# EAGLE schematic Synth (EAGLE 9.6.2)

## Sheet 1 of 3
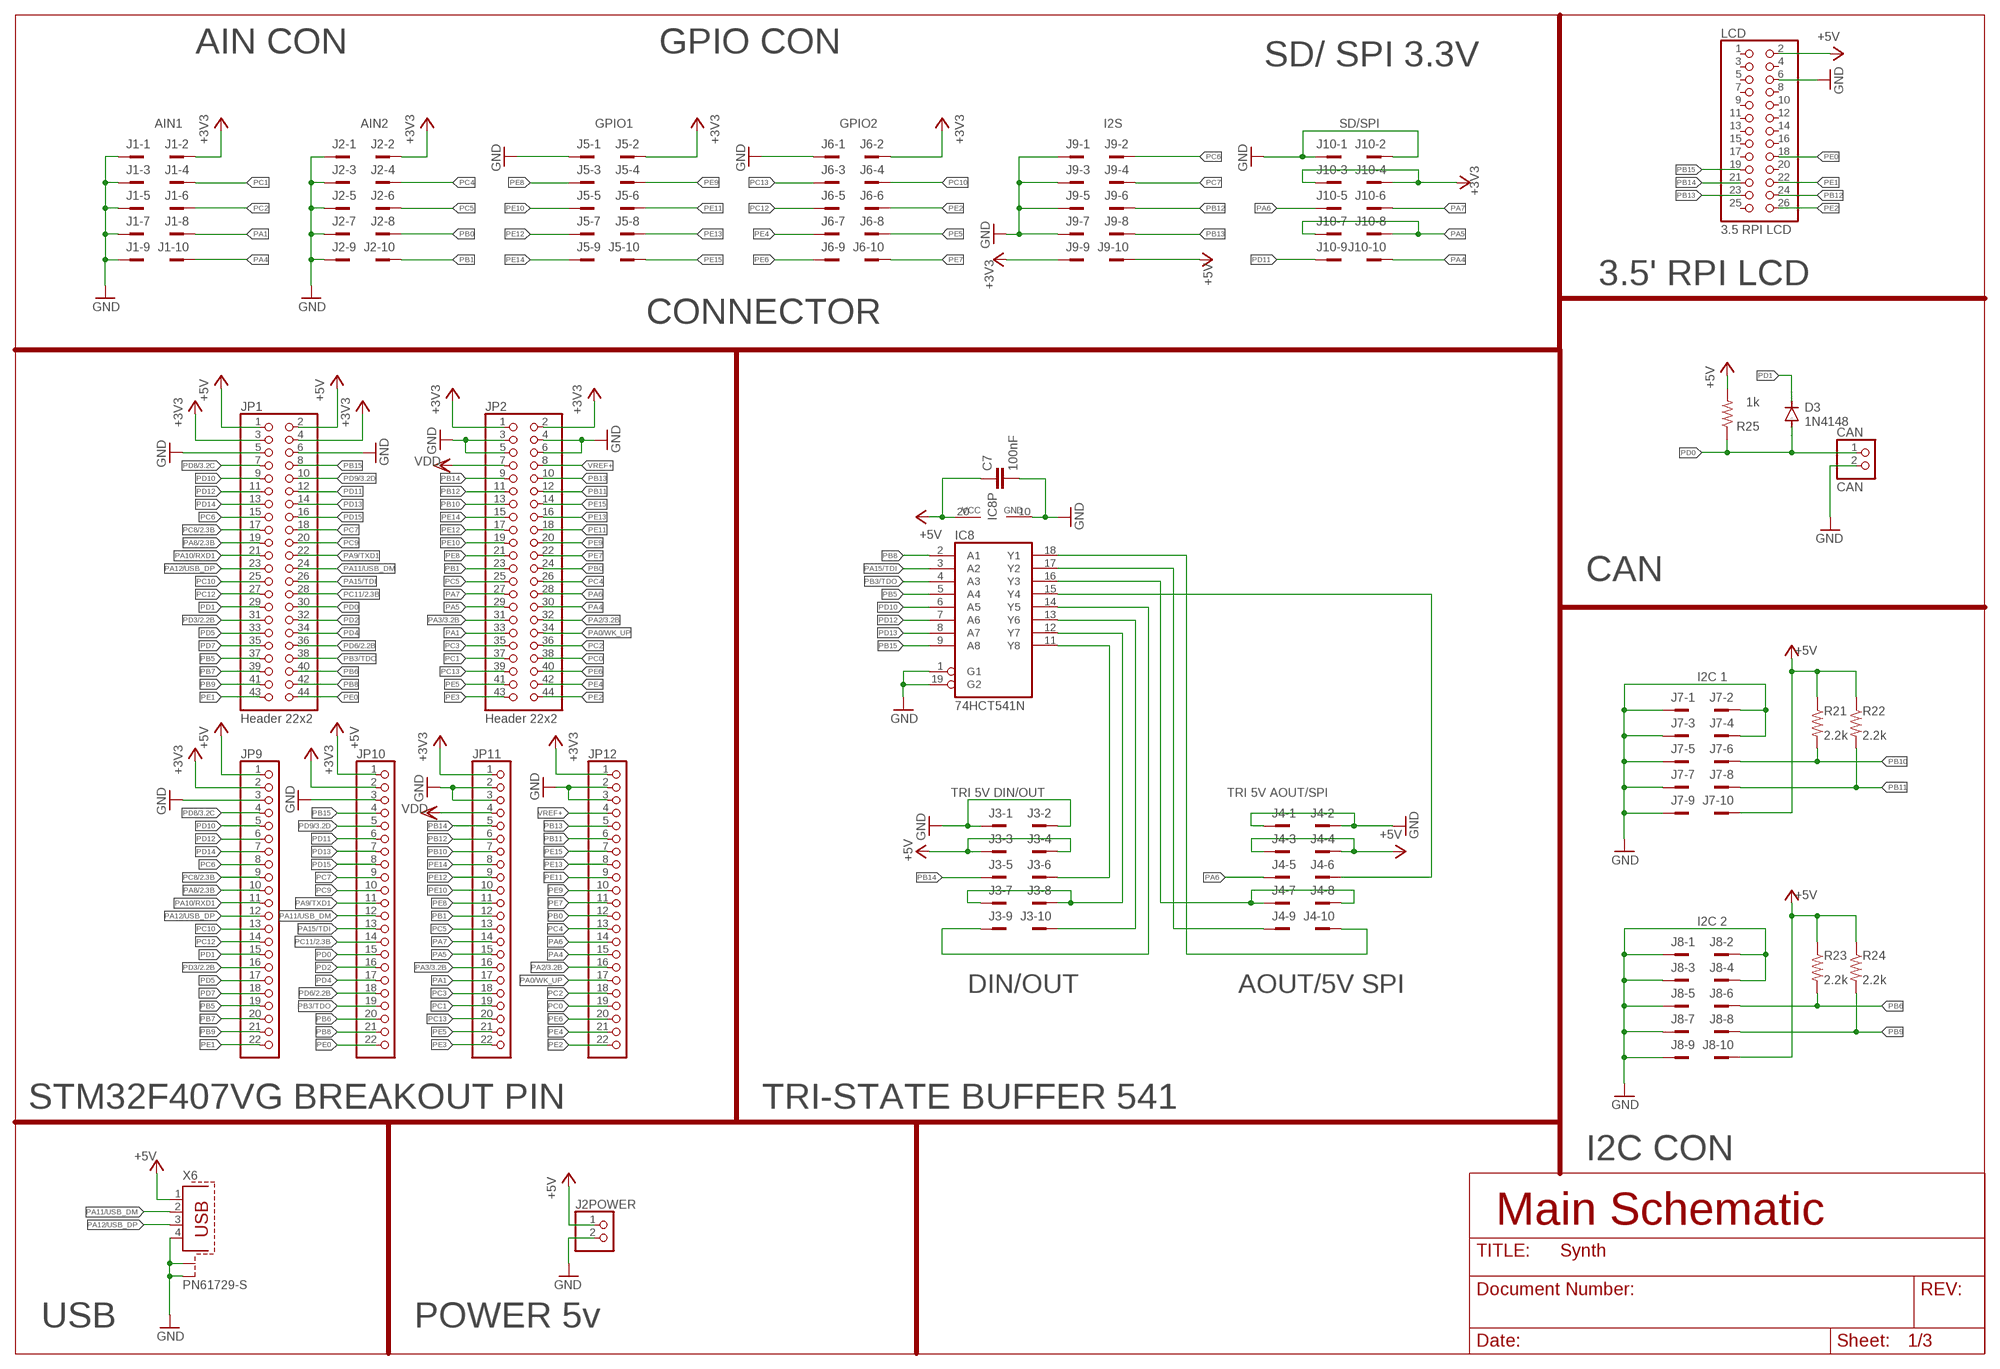
[diagram p0: schematic, sheet 1]
FRAME1 (DINA3_L): TITLE: Main Schematic

### Parts
C7  100nF  C-EU025-025X050  [C025-025X050]
CAN  CAN  PINHD-1X2  [1X02]
D3  1N4148  1N4148DO35-10  [DO35-10]
IC8  74HCT541N  [DIL20]
J1  AIN1  2510-  [PAK100/2500-10]
J2  AIN2  2510-  [PAK100/2500-10]
J2POWER  PINHD-1X2  [1X02]
J3  TRI 5V DIN/OUT  2510-  [PAK100/2500-10]
J4  TRI 5V AOUT/SPI  2510-  [PAK100/2500-10]
J5  GPIO1  2510-  [PAK100/2500-10]
J6  GPIO2  2510-  [PAK100/2500-10]
J7  I2C 1  2510-  [PAK100/2500-10]
J8  I2C 2  2510-  [PAK100/2500-10]
J9  I2S  2510-  [PAK100/2500-10]
J10  SD/SPI  2510-  [PAK100/2500-10]
JP1  Header 22x2  PINHD-2X22  [2X22]
JP2  Header 22x2  PINHD-2X22  [2X22]
JP9  PINHD-1X22  [1X22]
JP10  PINHD-1X22  [1X22]
JP11  PINHD-1X22  [1X22]
JP12  PINHD-1X22  [1X22]
LCD  3.5 RPI LCD  PINHD-2X13  [2X13]
R21  2.2k  R-US_0207/10  [0207/10]
R22  2.2k  R-US_0207/10  [0207/10]
R23  2.2k  R-US_0207/10  [0207/10]
R24  2.2k  R-US_0207/10  [0207/10]
R25  1k  R-US_0207/10  [0207/10]
X6  PN61729-S  [PN61729-S]

### Nets
+3V3: J1.2 J2.2 J5.2 J6.2 J9.9 J10.3 J10.4 JP1.3 JP1.4 JP2.1 JP2.2 JP9.2 JP10.2 JP11.1 JP12.1 ; also sheet 2
+5V: C7.1 IC8.20(VCC) J2POWER.1 J3.3 J3.4 J4.3 J4.4 J7.10 J8.10 J9.10 JP1.1 JP1.2 JP9.1 JP10.1 LCD.2 R21.1 R22.1 R23.1 R24.1 R25.2 X6.1 ; also sheet 2,3
GND: C7.2 CAN.2 IC8.1(G1) IC8.10(GND) IC8.19(G2) J1.1 J1.3 J1.5 J1.7 J1.9 J2.1 J2.3 J2.5 J2.7 J2.9 J2POWER.2 J3.1 J3.2 J4.1 J4.2 J5.1 J6.1 J7.1 J7.2 J7.3 J7.4 J7.5 J7.7 J7.9 J8.1 J8.2 J8.3 J8.4 J8.5 J8.7 J8.9 J9.1 J9.3 J9.5 J9.7 J10.1 J10.2 JP1.5 JP1.6 JP2.3 JP2.4 JP2.5 JP2.6 JP9.3 JP10.3 JP11.2 JP11.3 JP12.2 JP12.3 LCD.6 X6.4 X6.S1 X6.S2 ; also sheet 2,3
N$37: IC8.15(Y4) J4.6
N$38: IC8.12(Y7) J3.7 J3.8
N$39: IC8.11(Y8) J3.6
N$40: IC8.13(Y6) J3.10
N$41: IC8.14(Y5) J3.9
N$43: IC8.16(Y3) J4.7 J4.8
N$44: IC8.17(Y2) J4.9
N$45: IC8.18(Y1) J4.10
PA0/WK_UP: JP2.34 JP12.17
PA1: J1.8 JP2.33 JP11.17
PA2: JP2.32 JP12.16 ; also sheet 3
PA3: JP2.31 JP11.16 ; also sheet 3
PA4: J1.10 J10.10 JP2.30 JP12.15
PA5: J10.7 J10.8 JP2.29 JP11.15
PA6: J4.5 J10.5 JP2.28 JP12.14
PA7: J10.6 JP2.27 JP11.14
PA8: JP1.19 JP9.10 ; also sheet 2
PA9/TXD1: JP1.22 JP10.11
PA10/RXD1: JP1.21 JP9.11
PA11/USB_DM: JP1.24 JP10.12 X6.2
PA12/USB_DP: JP1.23 JP9.12 X6.3
PA15/TDI: IC8.3(A2) JP1.26 JP10.13
PB0: J2.8 JP2.24 JP12.12
PB1: J2.10 JP2.23 JP11.12
PB3/TDO: IC8.4(A3) JP1.38 JP10.19
PB5: IC8.5(A4) JP1.37 JP9.19
PB6: J8.6 JP1.40 JP10.20 R23.2
PB7: JP1.39 JP9.20
PB8: IC8.2(A1) JP1.42 JP10.21
PB9: J8.8 JP1.41 JP9.21 R24.2
PB10: J7.6 JP2.13 JP11.7 R21.2
PB11: J7.8 JP2.12 JP12.6 R22.2
PB12: J9.6 JP2.11 JP11.6 LCD.24
PB13: J9.8 JP2.10 JP12.5 LCD.23
PB14: J3.5 JP2.9 JP11.5 LCD.21
PB15: IC8.9(A8) JP1.8 JP10.4 LCD.19
PC0: JP2.38 JP12.19
PC1: J1.4 JP2.37 JP11.19
PC2: J1.6 JP2.36 JP12.18
PC3: JP2.35 JP11.18
PC4: J2.4 JP2.26 JP12.13
PC5: J2.6 JP2.25 JP11.13
PC6: J9.2 JP1.15 JP9.8
PC7: J9.4 JP1.18 JP10.9
PC8: JP1.17 JP9.9 ; also sheet 2
PC9: JP1.20 JP10.10
PC10: J6.4 JP1.25 JP9.13
PC11: JP1.28 JP10.14 ; also sheet 2
PC12: J6.5 JP1.27 JP9.14
PC13: J6.3 JP2.39 JP11.20
PD0: CAN.1 D3.A JP1.30 JP10.15 R25.1
PD1: D3.C JP1.29 JP9.15
PD2: JP1.32 JP10.16
PD3: JP1.31 JP9.16 ; also sheet 2
PD4: JP1.34 JP10.17
PD5: JP1.33 JP9.17
PD6: JP1.36 JP10.18 ; also sheet 2
PD7: JP1.35 JP9.18
PD8: JP1.7 JP9.4 ; also sheet 3
PD9: JP1.10 JP10.5 ; also sheet 3
PD10: IC8.6(A5) JP1.9 JP9.5
PD11: J10.9 JP1.12 JP10.6
PD12: IC8.7(A6) JP1.11 JP9.6
PD13: IC8.8(A7) JP1.14 JP10.7
PD14: JP1.13 JP9.7
PD15: JP1.16 JP10.8
PE0: JP1.44 JP10.22 LCD.18
PE1: JP1.43 JP9.22 LCD.22
PE2: J6.6 JP2.44 JP12.22 LCD.26
PE3: JP2.43 JP11.22
PE4: J6.7 JP2.42 JP12.21
PE5: J6.8 JP2.41 JP11.21
PE6: J6.9 JP2.40 JP12.20
PE7: J6.10 JP2.22 JP12.11
PE8: J5.3 JP2.21 JP11.11
PE9: J5.4 JP2.20 JP12.10
PE10: J5.5 JP2.19 JP11.10
PE11: J5.6 JP2.18 JP12.9
PE12: J5.7 JP2.17 JP11.9
PE13: J5.8 JP2.16 JP12.8
PE14: J5.9 JP2.15 JP11.8
PE15: J5.10 JP2.14 JP12.7
VDD: JP2.7 JP11.4
VREF+: JP2.8 JP12.4
Unconnected: LCD.1 LCD.3 LCD.4 LCD.5 LCD.7 LCD.8 LCD.9 LCD.10 LCD.11 LCD.12 LCD.13 LCD.14 LCD.15 LCD.16 LCD.17 LCD.20 LCD.25

### Notes on the sheet
- AIN CON | GPIO CON
- SD/ SPI 3.3V
- 3.5' RPI LCD
- CONNECTOR
- CAN
- DIN/OUT | AOUT/5V SPI
- STM32F407VG BREAKOUT PIN | TRI-STATE BUFFER 541
- I2C CON
- USB | POWER 5v

## Sheet 2 of 3
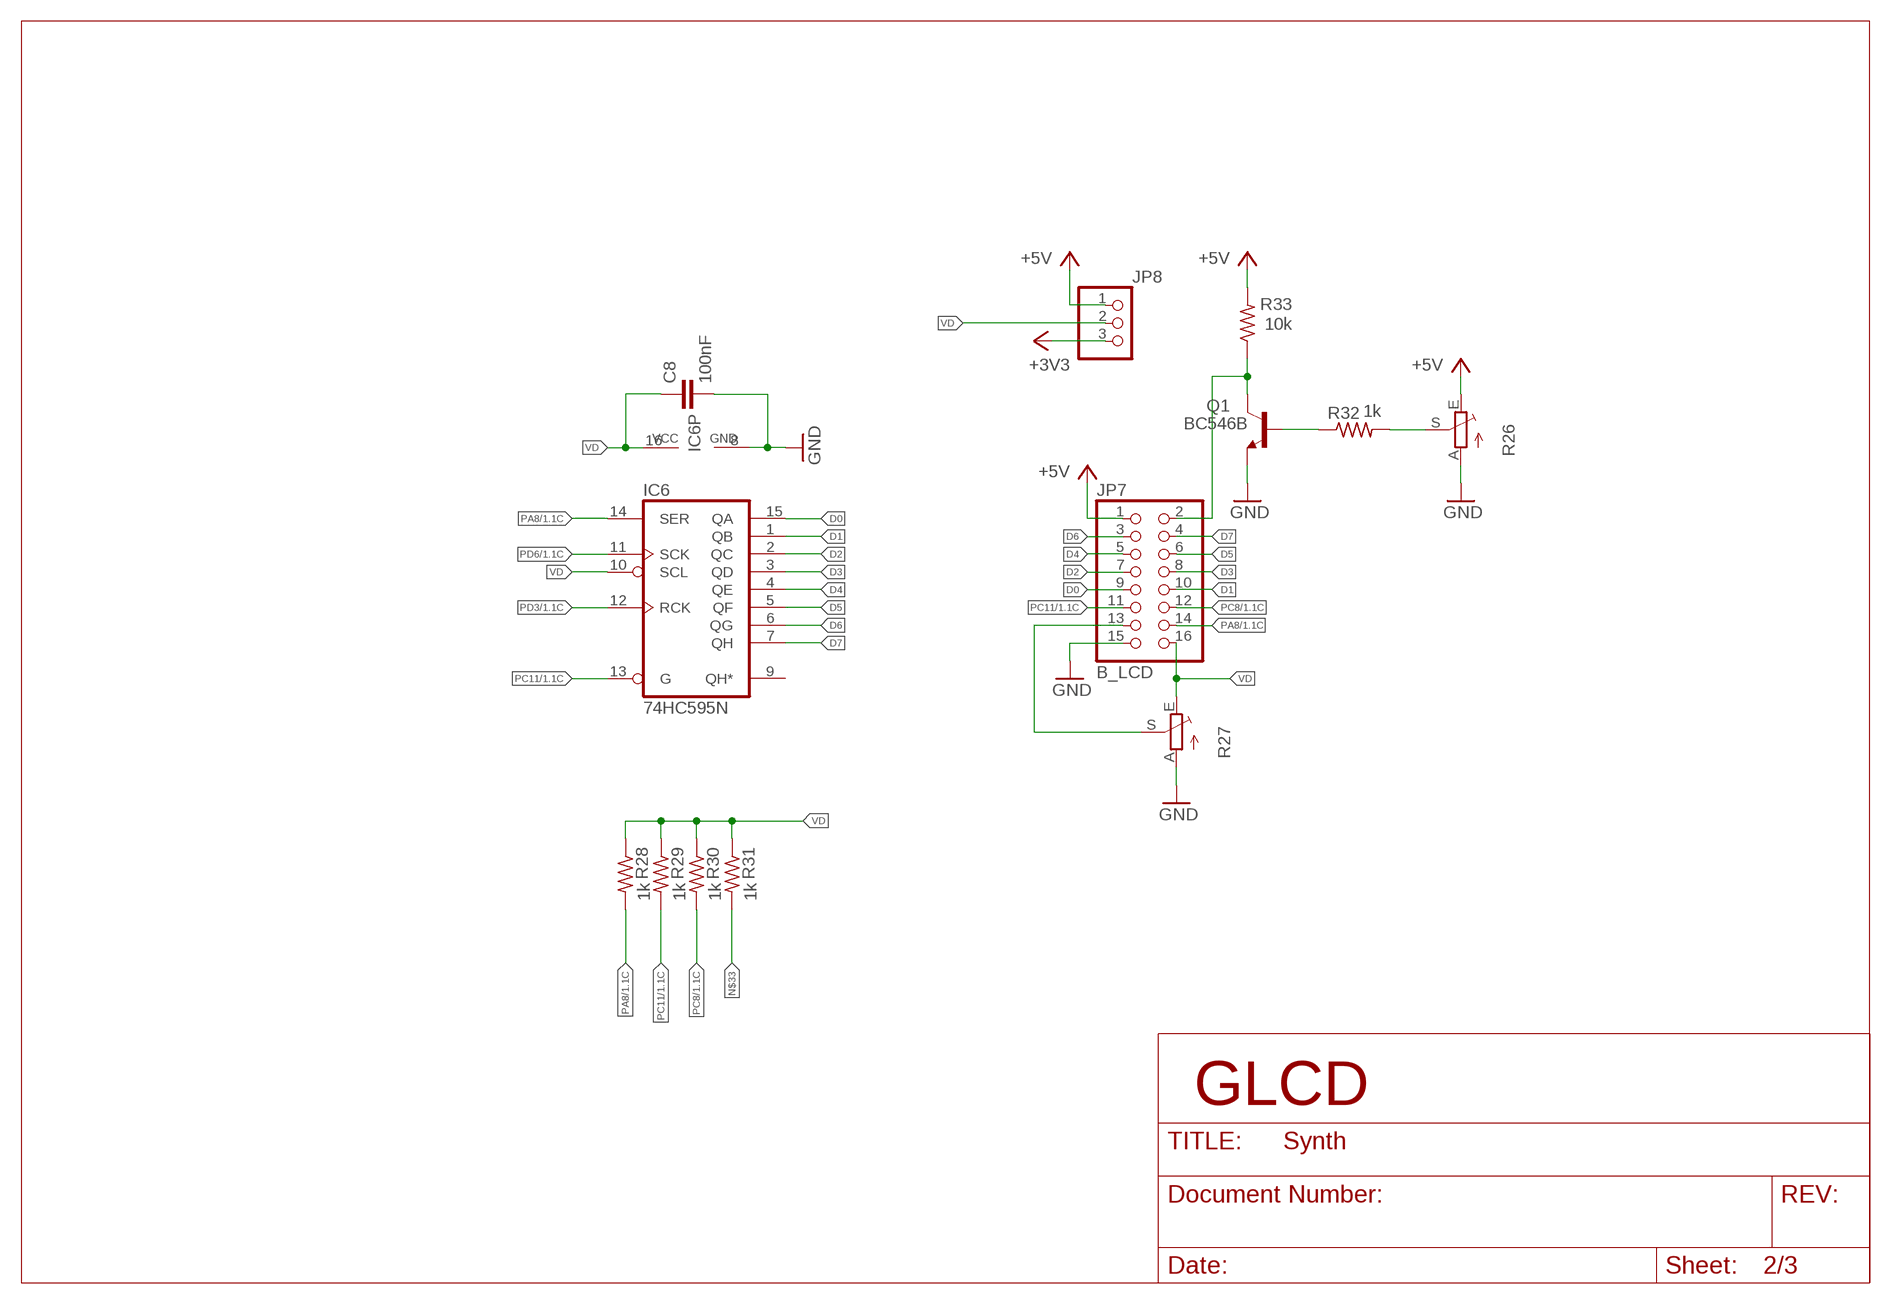
[diagram p1: schematic, sheet 2]
FRAME2 (DINA4_L): TITLE: GLCD

### Parts
C8  100nF  C-EU025-025X050  [C025-025X050]
IC6  74HC595N  [DIL16]
JP7  B_LCD  PINHD-2X8  [2X08]
JP8  PINHD-1X3  [1X03]
Q1  BC546B  [TO92-EBC]
R26  TRIM_EU-CA6V  [CA6V]
R27  TRIM_EU-CA6V  [CA6V]
R28  1k  R-US_0207/10  [0207/10]
R29  1k  R-US_0207/10  [0207/10]
R30  1k  R-US_0207/10  [0207/10]
R31  1k  R-US_0207/10  [0207/10]
R32  1k  R-US_0207/10  [0207/10]
R33  10k  R-US_0207/10  [0207/10]

### Nets
+3V3: JP8.3 ; also sheet 1
+5V: JP7.1 JP8.1 R26.E R33.2 ; also sheet 1,3
D0: IC6.15(QA) JP7.9
D1: IC6.1(QB) JP7.10
D2: IC6.2(QC) JP7.7
D3: IC6.3(QD) JP7.8
D4: IC6.4(QE) JP7.5
D5: IC6.5(QF) JP7.6
D6: IC6.6(QG) JP7.3
D7: IC6.7(QH) JP7.4
GND: C8.2 IC6.8(GND) JP7.15 Q1.E R26.A R27.A ; also sheet 1,3
N$30: JP7.13 R27.S
N$33: R31.2
N$46: JP7.2 Q1.C R33.1
N$47: Q1.B R32.1
N$48: R26.S R32.2
PA8: IC6.14(SER) JP7.14 R28.2 ; also sheet 1
PC8: JP7.12 R30.2 ; also sheet 1
PC11: IC6.13(G) JP7.11 R29.2 ; also sheet 1
PD3: IC6.12(RCK) ; also sheet 1
PD6: IC6.11(SCK) ; also sheet 1
VD: C8.1 IC6.10(SCL) IC6.16(VCC) JP7.16 JP8.2 R27.E R28.1 R29.1 R30.1 R31.1
Unconnected: IC6.9(QH*)

## Sheet 3 of 3
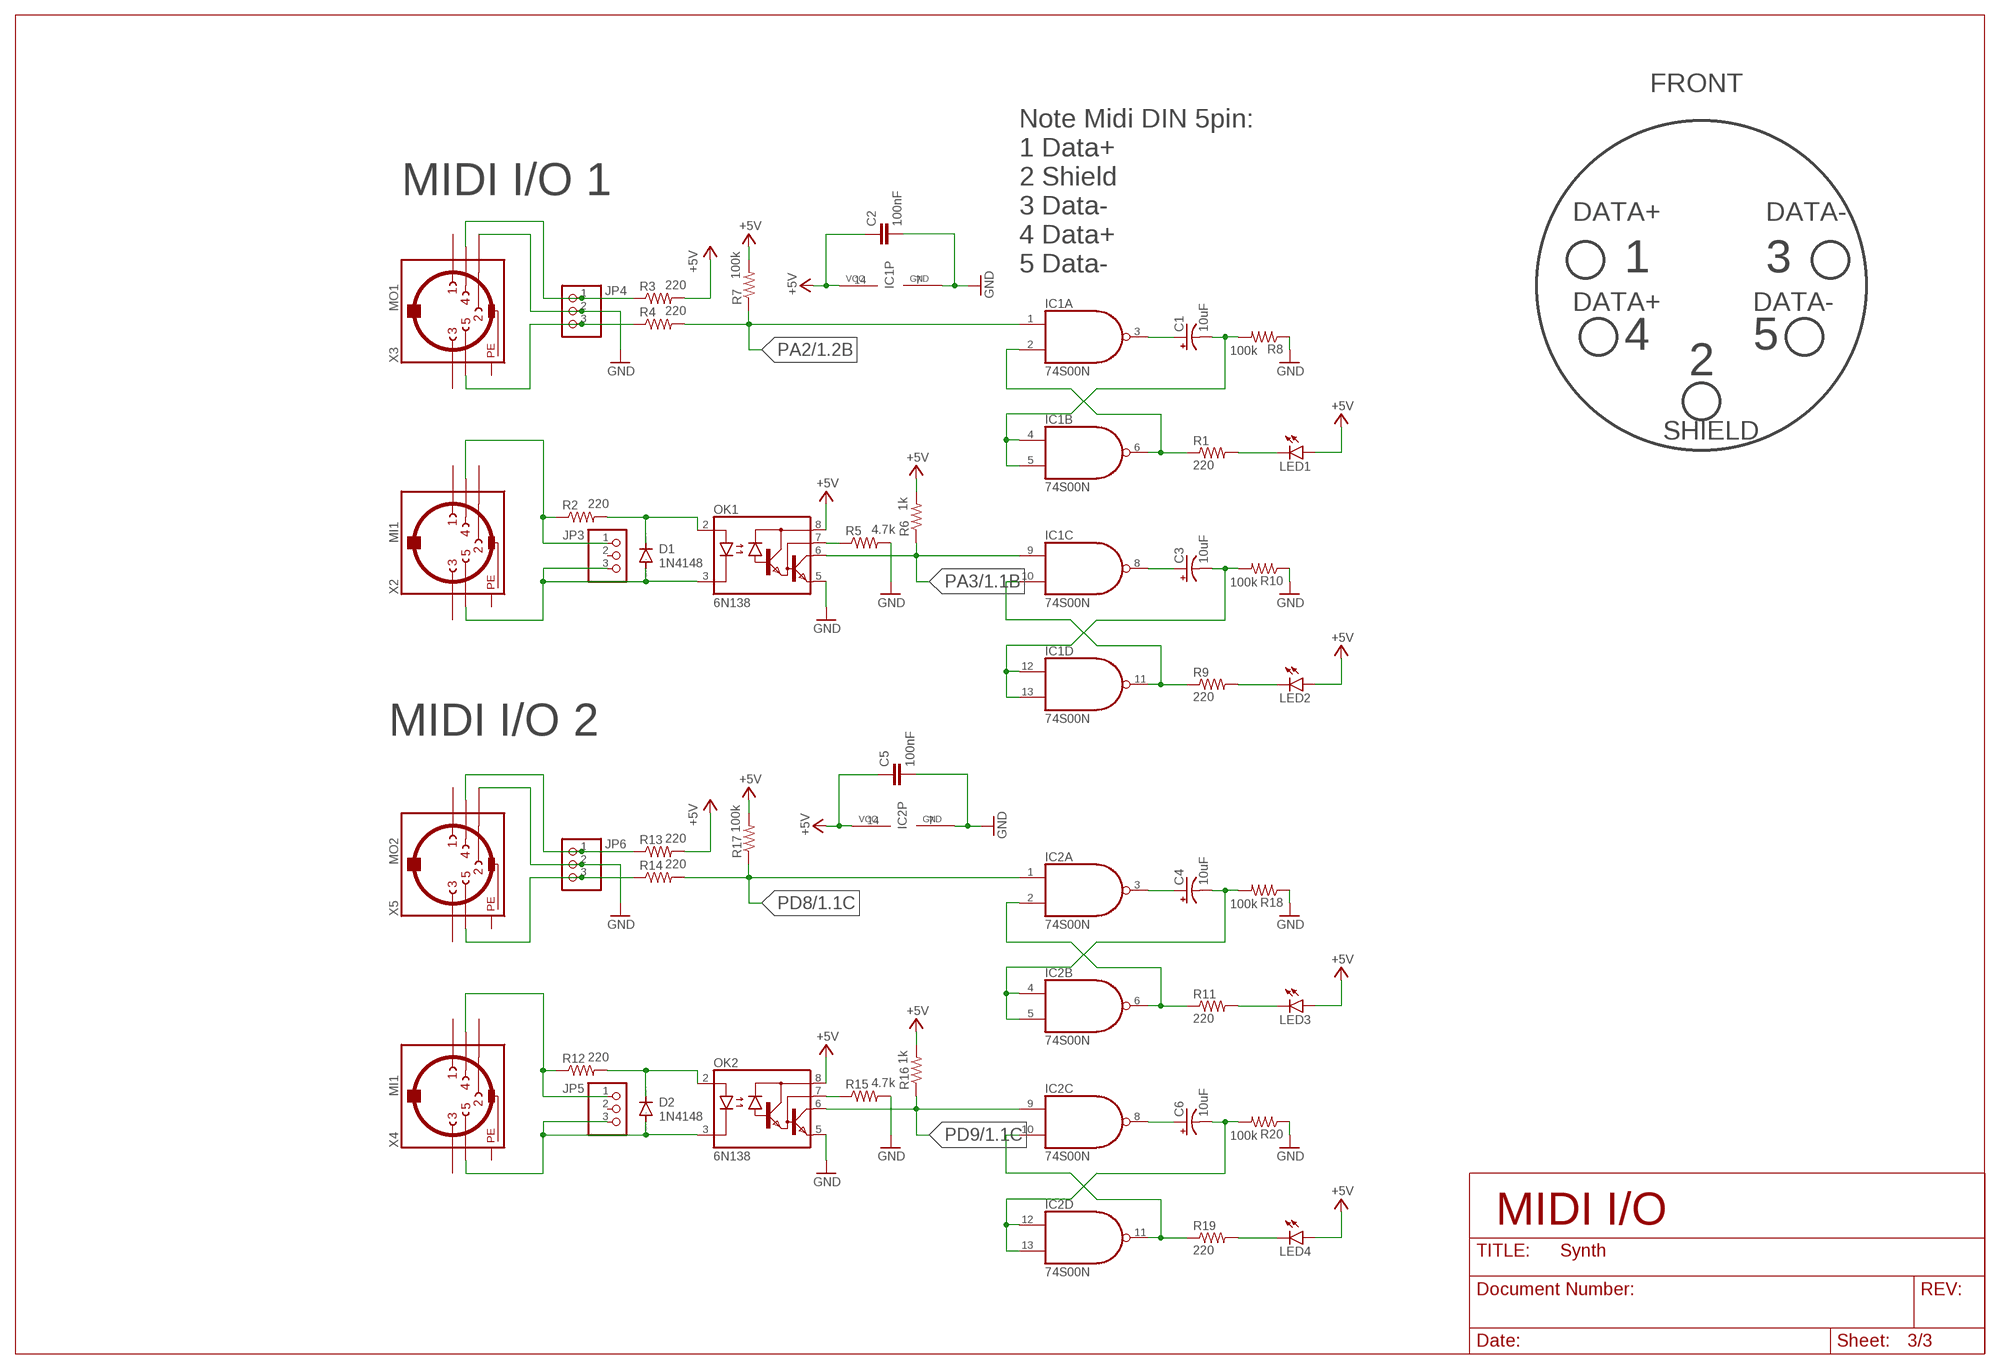
[diagram p2: schematic, sheet 3]
FRAME3 (DINA3_L): TITLE: MIDI I/O

### Parts
C1  10uF  CPOL-USE3.5-8  [E3,5-8]
C2  100nF  C-EU025-025X050  [C025-025X050]
C3  10uF  CPOL-USE3.5-8  [E3,5-8]
C4  10uF  CPOL-USE3.5-8  [E3,5-8]
C5  100nF  C-EU025-025X050  [C025-025X050]
C6  10uF  CPOL-USE3.5-8  [E3,5-8]
D1  1N4148  1N4148DO35-10  [DO35-10]
D2  1N4148  1N4148DO35-10  [DO35-10]
IC1  74S00N  [DIL14]
IC2  74S00N  [DIL14]
JP3  PINHD-1X3  [1X03]
JP4  PINHD-1X3  [1X03]
JP5  PINHD-1X3  [1X03]
JP6  PINHD-1X3  [1X03]
LED1  LED3MM  [LED3MM]
LED2  LED3MM  [LED3MM]
LED3  LED3MM  [LED3MM]
LED4  LED3MM  [LED3MM]
OK1  6N138  [DIL08]
OK2  6N138  [DIL08]
R1  220  R-US_0207/10  [0207/10]
R2  220  R-US_0207/10  [0207/10]
R3  220  R-US_0207/10  [0207/10]
R4  220  R-US_0207/10  [0207/10]
R5  4.7k  R-US_0207/10  [0207/10]
R6  1k  R-US_0207/10  [0207/10]
R7  100k  R-US_0207/10  [0207/10]
R8  100k  R-US_0207/10  [0207/10]
R9  220  R-US_0207/10  [0207/10]
R10  100k  R-US_0207/10  [0207/10]
R11  220  R-US_0207/10  [0207/10]
R12  220  R-US_0207/10  [0207/10]
R13  220  R-US_0207/10  [0207/10]
R14  220  R-US_0207/10  [0207/10]
R15  4.7k  R-US_0207/10  [0207/10]
R16  1k  R-US_0207/10  [0207/10]
R17  100k  R-US_0207/10  [0207/10]
R18  100k  R-US_0207/10  [0207/10]
R19  220  R-US_0207/10  [0207/10]
R20  100k  R-US_0207/10  [0207/10]
X2  MI1  MAB5SH  [MAB5SH]
X3  MO1  MAB5SH  [MAB5SH]
X4  MI1  MAB5SH  [MAB5SH]
X5  MO2  MAB5SH  [MAB5SH]

### Nets
+5V: C2.1 C5.1 IC1.14(P:VCC) IC2.14(P:VCC) LED1.A LED2.A LED3.A LED4.A OK1.8(VCC) OK2.8(VCC) R3.2 R6.2 R7.2 R13.2 R16.2 R17.2 ; also sheet 1,2
GND: C2.2 C5.2 IC1.7(P:GND) IC2.7(P:GND) JP4.2 JP6.2 OK1.5(GND) OK2.5(GND) R5.2 R8.1 R10.1 R15.2 R18.1 R20.1 X3.2 X5.2 ; also sheet 1,2
N$1: D1.C OK1.2(A) R2.2
N$2: D1.A JP3.3 OK1.3(C) X2.5
N$3: JP3.1 R2.1 X2.4
N$4: D2.C OK2.2(A) R12.2
N$5: OK1.7(VB) R5.1
N$6: JP4.3 R4.1 X3.5
N$7: D2.A JP5.3 OK2.3(C) X4.5
N$8: JP4.1 R3.1 X3.4
N$9: IC1.2(A:I1) IC1.6(B:O) R1.1
N$10: C1.- IC1.4(B:I0) IC1.5(B:I1) R8.2
N$11: C1.+ IC1.3(A:O)
N$12: LED1.K(C) R1.2
N$13: IC1.10(C:I1) IC1.11(D:O) R9.1
N$14: C3.- IC1.12(D:I0) IC1.13(D:I1) R10.2
N$15: C3.+ IC1.8(C:O)
N$16: LED2.K(C) R9.2
N$17: JP5.1 R12.1 X4.4
N$18: JP6.3 R14.1 X5.5
N$19: JP6.1 R13.1 X5.4
N$20: OK2.7(VB) R15.1
N$21: IC2.2(A:I1) IC2.6(B:O) R11.1
N$22: C4.- IC2.4(B:I0) IC2.5(B:I1) R18.2
N$23: C4.+ IC2.3(A:O)
N$24: LED3.K(C) R11.2
N$25: IC2.10(C:I1) IC2.11(D:O) R19.1
N$26: C6.- IC2.12(D:I0) IC2.13(D:I1) R20.2
N$27: C6.+ IC2.8(C:O)
N$28: LED4.K(C) R19.2
PA2: IC1.1(A:I0) R4.2 R7.1 ; also sheet 1
PA3: IC1.9(C:I0) OK1.6(VO) R6.1 ; also sheet 1
PD8: IC2.1(A:I0) R14.2 R17.1 ; also sheet 1
PD9: IC2.9(C:I0) OK2.6(VO) R16.1 ; also sheet 1
Unconnected: JP3.2 JP5.2 X2.1 X2.2 X2.3 X3.1 X3.3 X4.1 X4.2 X4.3 X5.1 X5.3

### Notes on the sheet
- FRONT
- MIDI I/O 1
- DATA+ | DATA-
- Note Midi DIN 5pin:
  1 Data+
  2 Shield
  3 Data-
  4 Data+
  5 Data-
- 1 | 3
- DATA+ | DATA-
- 4 | 5
- 2
- SHIELD
- MIDI I/O 2

## Power pins joined to a net without a drawn wire
PE: X2.PE X2.PE@(PE) X3.PE X3.PE@(PE) X4.PE X4.PE@(PE) X5.PE X5.PE@(PE)

## Library data of the parts
C1 C3 C4 C6 = rcl:CPOL-US: POLARIZED CAPACITOR, American symbol; SPICEPREFIX: C
C2 C5 C7 C8 = rcl:C-EU: CAPACITOR, European symbol; SPICEPREFIX: C
CAN J2POWER = pinhead:PINHD-1X2: PIN HEADER
D1-D3 = diode:1N4148: DIODE high speed (Philips)
IC1 IC2 = 74xx-us:74*00: Quad 2-input NAND gate
IC6 = 74xx-eu:74*595: 8-bit SHIFT REGISTER, output latch
IC8 = 74xx-eu:74*541: Octal BUFFER and LINE DRIVER, 3-state
J1-J10 = con-3m:2510-: 3M (TM) Pak 100 4-Wall Header Source: 3M; MF: 3M; MPN: 2510-6002UB; OC_FARNELL: 9838244; OC_NEWARK: 46F4725
JP1 JP2 = pinhead:PINHD-2X22: PIN HEADER
JP3-JP6 JP8 = pinhead:PINHD-1X3: PIN HEADER
JP7 = pinhead:PINHD-2X8: PIN HEADER
JP9-JP12 = pinhead:PINHD-1X22: PIN HEADER
LCD = pinhead:PINHD-2X13: PIN HEADER
LED1-LED4 = led:LED: LED OSRAM: - CHIPLED LG R971, LG N971, LY N971, LG Q971, LY Q971, LO R971, LY R971 LH N974, LH R974 LS Q976, LO Q976, LY Q976 LO Q996 - Hyper CHIPLED LW Q18S LB Q993, LB Q99A, LB R99A - SideLED LS A670, LO A670, LY A670, LG A670, LP A670 LB A673, LV A673, LT A673, LW A673 LH A674 LY A675 LS A676, LA A676, LO A676, LY A676, LW A676 LS A679, LY A679, LG A679 - Hyper Micro SIDELED® LS Y876, LA Y876, LO Y876, LY Y876 LT Y87S - SmartLED LW L88C, LW L88S LB L89C, LB L89S, LG L890 LS L89K, LO L89K, LY L89K LS L896, LA L896, LO L896, LY L896 - TOPLED LS T670, LO T670, LY T670, LG T670, LP T670 LSG T670, LSP T670, LSY T670, LOP T670, LYG T670 LG T671, LOG T671, LSG T671 LB T673, LV T673, LT T673, LW T673 LH T674 LS T676, LA T676, LO T676, LY T676, LB T676, LH T676, LSB T676, LW T676 LB T67C, LV T67C, LT T67C, LS T67K, LO T67K, LY T67K, LW E67C LS E67B, LA E67B, LO E67B, LY E67B, LB E67C, LV E67C, LT E67C LW T67C LS T679, LY T679, LG T679 LS T770, LO T770, LY T770, LG T770, LP T770 LB T773, LV T773, LT T773, LW T773 LH T774 LS E675, LA E675, LY E675, LS T675 LS T776, LA T776, LO T776, LY T776, LB T776 LHGB T686 LT T68C, LB T68C - Hyper Mini TOPLED® LB M676 - Mini TOPLED Santana® LG M470 LS M47K, LO M47K, LY M47K Source: http://www.osram.convergy.de LUXEON: - LUMILED® LXK2-PW12-R00, LXK2-PW12-S00, LXK2-PW14-U00, LXK2-PW14-V00 LXK2-PM12-R00, LXK2-PM12-S00, LXK2-PM14-U00 LXK2-PE12-Q00, LXK2-PE12-R00, LXK2-PE12-S00, LXK2-PE14-T00, LXK2-PE14-U00 LXK2-PB12-K00, LXK2-PB12-L00, LXK2-PB12-M00, LXK2-PB14-N00, LXK2-PB14-P00, LXK2-PB14-Q00 LXK2-PR12-L00, LXK2-PR12-M00, LXK2-PR14-Q00, LXK2-PR14-R00 LXK2-PD12-Q00, LXK2-PD12-R00, LXK2-PD12-S00 LXK2-PH12-R00, LXK2-PH12-S00 LXK2-PL12-P00, LXK2-PL12-Q00, LXK2-PL12-R00 Source: www.luxeon.com KINGBRIGHT: KA-3528ASYC Source: www.kingbright.com
OK1 OK2 = optocoupler:6N138: MOTOROLA OPTO COUPLER; MF: VISHAY/TELEFUNKEN; MPN: 6N138; OC_FARNELL: 9860150; OC_NEWARK: 35K5294
Q1 = transistor-npn:BC546*: NPN Transistor
R1-R25 R28-R33 = rcl:R-US_: RESISTOR, American symbol; SPICEPREFIX: R
R26 R27 = pot:TRIM_EU-: POTENTIOMETER
X2-X5 = con-hirschmann:MAB5SH: Female CONNECTOR 5 pins 90 deg. with shield, horizontal (DIN 41524); OC_FARNELL: 809883; OC_NEWARK: unknown
X6 = con-berg:PN61729-S: BERG USB connector; OC_FARNELL: unknown; OC_NEWARK: unknown

## Net classes
0 default: clearance 0.15 mm